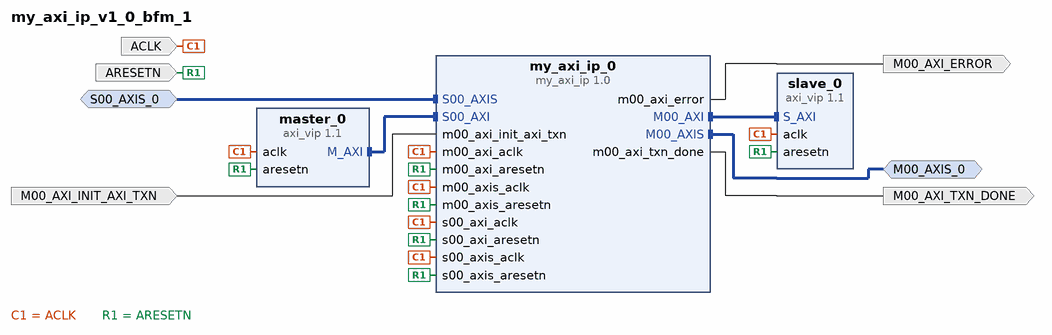
[diagram p0: block diagram of the top level]
# Vivado block design my_axi_ip_v1_0_bfm_1, xczu3cg-sfvc784-1-e, Vivado 2021.1
create_bd_design my_axi_ip_v1_0_bfm_1

create_bd_intf_port -mode Slave -vlnv xilinx.com:interface:axis_rtl:1.0 S00_AXIS_0
set_property -dict [list \
  CONFIG.CLK_DOMAIN my_axi_ip_v1_0_bfm_1_ACLK \
  CONFIG.HAS_TKEEP 0 \
  CONFIG.HAS_TLAST 1 \
  CONFIG.HAS_TREADY 1 \
  CONFIG.HAS_TSTRB 1 \
  CONFIG.LAYERED_METADATA undef \
  CONFIG.PHASE 0.000 \
  CONFIG.TDATA_NUM_BYTES 4 \
  CONFIG.TDEST_WIDTH 0 \
  CONFIG.TID_WIDTH 0 \
  CONFIG.TUSER_WIDTH 0 \
] [get_bd_intf_ports S00_AXIS_0]
create_bd_intf_port -mode Master -vlnv xilinx.com:interface:axis_rtl:1.0 M00_AXIS_0
set_property -dict {CONFIG.CLK_DOMAIN my_axi_ip_v1_0_bfm_1_ACLK CONFIG.PHASE 0.000} [get_bd_intf_ports M00_AXIS_0]
create_bd_port -dir I -type clk ACLK
set_property -dict [list \
  CONFIG.ASSOCIATED_RESET ARESETN \
  CONFIG.CLK_DOMAIN my_axi_ip_v1_0_bfm_1_ACLK \
  CONFIG.FREQ_HZ 100000000 \
  CONFIG.PHASE 0.000 \
] [get_bd_ports ACLK]
create_bd_port -dir I -type rst ARESETN
set_property -dict {CONFIG.POLARITY ACTIVE_LOW} [get_bd_ports ARESETN]
create_bd_port -dir I M00_AXI_INIT_AXI_TXN
create_bd_port -dir O M00_AXI_ERROR
create_bd_port -dir O M00_AXI_TXN_DONE

create_bd_cell -type ip -vlnv xilinx.com:user:my_axi_ip:1.0 my_axi_ip_0
create_bd_cell -type ip -vlnv xilinx.com:ip:axi_vip:1.1 master_0
set_property -dict [list \
  CONFIG.ADDR_WIDTH 32 \
  CONFIG.DATA_WIDTH 32 \
  CONFIG.HAS_BRESP 1 \
  CONFIG.HAS_PROT 1 \
  CONFIG.HAS_RRESP 1 \
  CONFIG.HAS_WSTRB 1 \
  CONFIG.INTERFACE_MODE MASTER \
  CONFIG.PROTOCOL AXI4LITE \
  CONFIG.READ_WRITE_MODE READ_WRITE \
] [get_bd_cells master_0]
create_bd_cell -type ip -vlnv xilinx.com:ip:axi_vip:1.1 slave_0
set_property -dict {CONFIG.INTERFACE_MODE SLAVE CONFIG.PROTOCOL AXI4} [get_bd_cells slave_0]

# ---- connections ----

connect_bd_intf_net -intf_net S00_AXIS_0_1 [get_bd_intf_ports S00_AXIS_0] [get_bd_intf_pins my_axi_ip_0/S00_AXIS]
connect_bd_intf_net [get_bd_intf_pins master_0/M_AXI] [get_bd_intf_pins my_axi_ip_0/S00_AXI]
connect_bd_intf_net [get_bd_intf_pins slave_0/S_AXI] [get_bd_intf_pins my_axi_ip_0/M00_AXI]
connect_bd_intf_net [get_bd_intf_ports M00_AXIS_0] [get_bd_intf_pins my_axi_ip_0/M00_AXIS]
connect_bd_net -net aclk_net [get_bd_ports ACLK] \
  [get_bd_pins master_0/aclk] [get_bd_pins my_axi_ip_0/s00_axi_aclk] [get_bd_pins slave_0/aclk] \
  [get_bd_pins my_axi_ip_0/m00_axi_aclk] [get_bd_pins my_axi_ip_0/s00_axis_aclk] [get_bd_pins my_axi_ip_0/m00_axis_aclk]
connect_bd_net -net aresetn_net [get_bd_ports ARESETN] \
  [get_bd_pins master_0/aresetn] [get_bd_pins my_axi_ip_0/s00_axi_aresetn] [get_bd_pins slave_0/aresetn] \
  [get_bd_pins my_axi_ip_0/m00_axi_aresetn] [get_bd_pins my_axi_ip_0/s00_axis_aresetn] \
  [get_bd_pins my_axi_ip_0/m00_axis_aresetn]
connect_bd_net -net error_00 [get_bd_pins my_axi_ip_0/m00_axi_error] [get_bd_ports M00_AXI_ERROR]
connect_bd_net -net init_axi_txn_00 [get_bd_ports M00_AXI_INIT_AXI_TXN] [get_bd_pins my_axi_ip_0/m00_axi_init_axi_txn]
connect_bd_net -net txn_done_00 [get_bd_pins my_axi_ip_0/m00_axi_txn_done] [get_bd_ports M00_AXI_TXN_DONE]

# ---- address map ----
assign_bd_address -offset 0x44A00000 -range 64K -target_address_space [get_bd_addr_spaces master_0/Master_AXI] [get_bd_addr_segs my_axi_ip_0/S00_AXI/S00_AXI_reg]
assign_bd_address -offset 0x44A00000 -range 64K -target_address_space [get_bd_addr_spaces my_axi_ip_0/M00_AXI] [get_bd_addr_segs slave_0/S_AXI/Reg]

validate_bd_design
save_bd_design
